# EAGLE design MicroSD_reg (EAGLE 6.2)
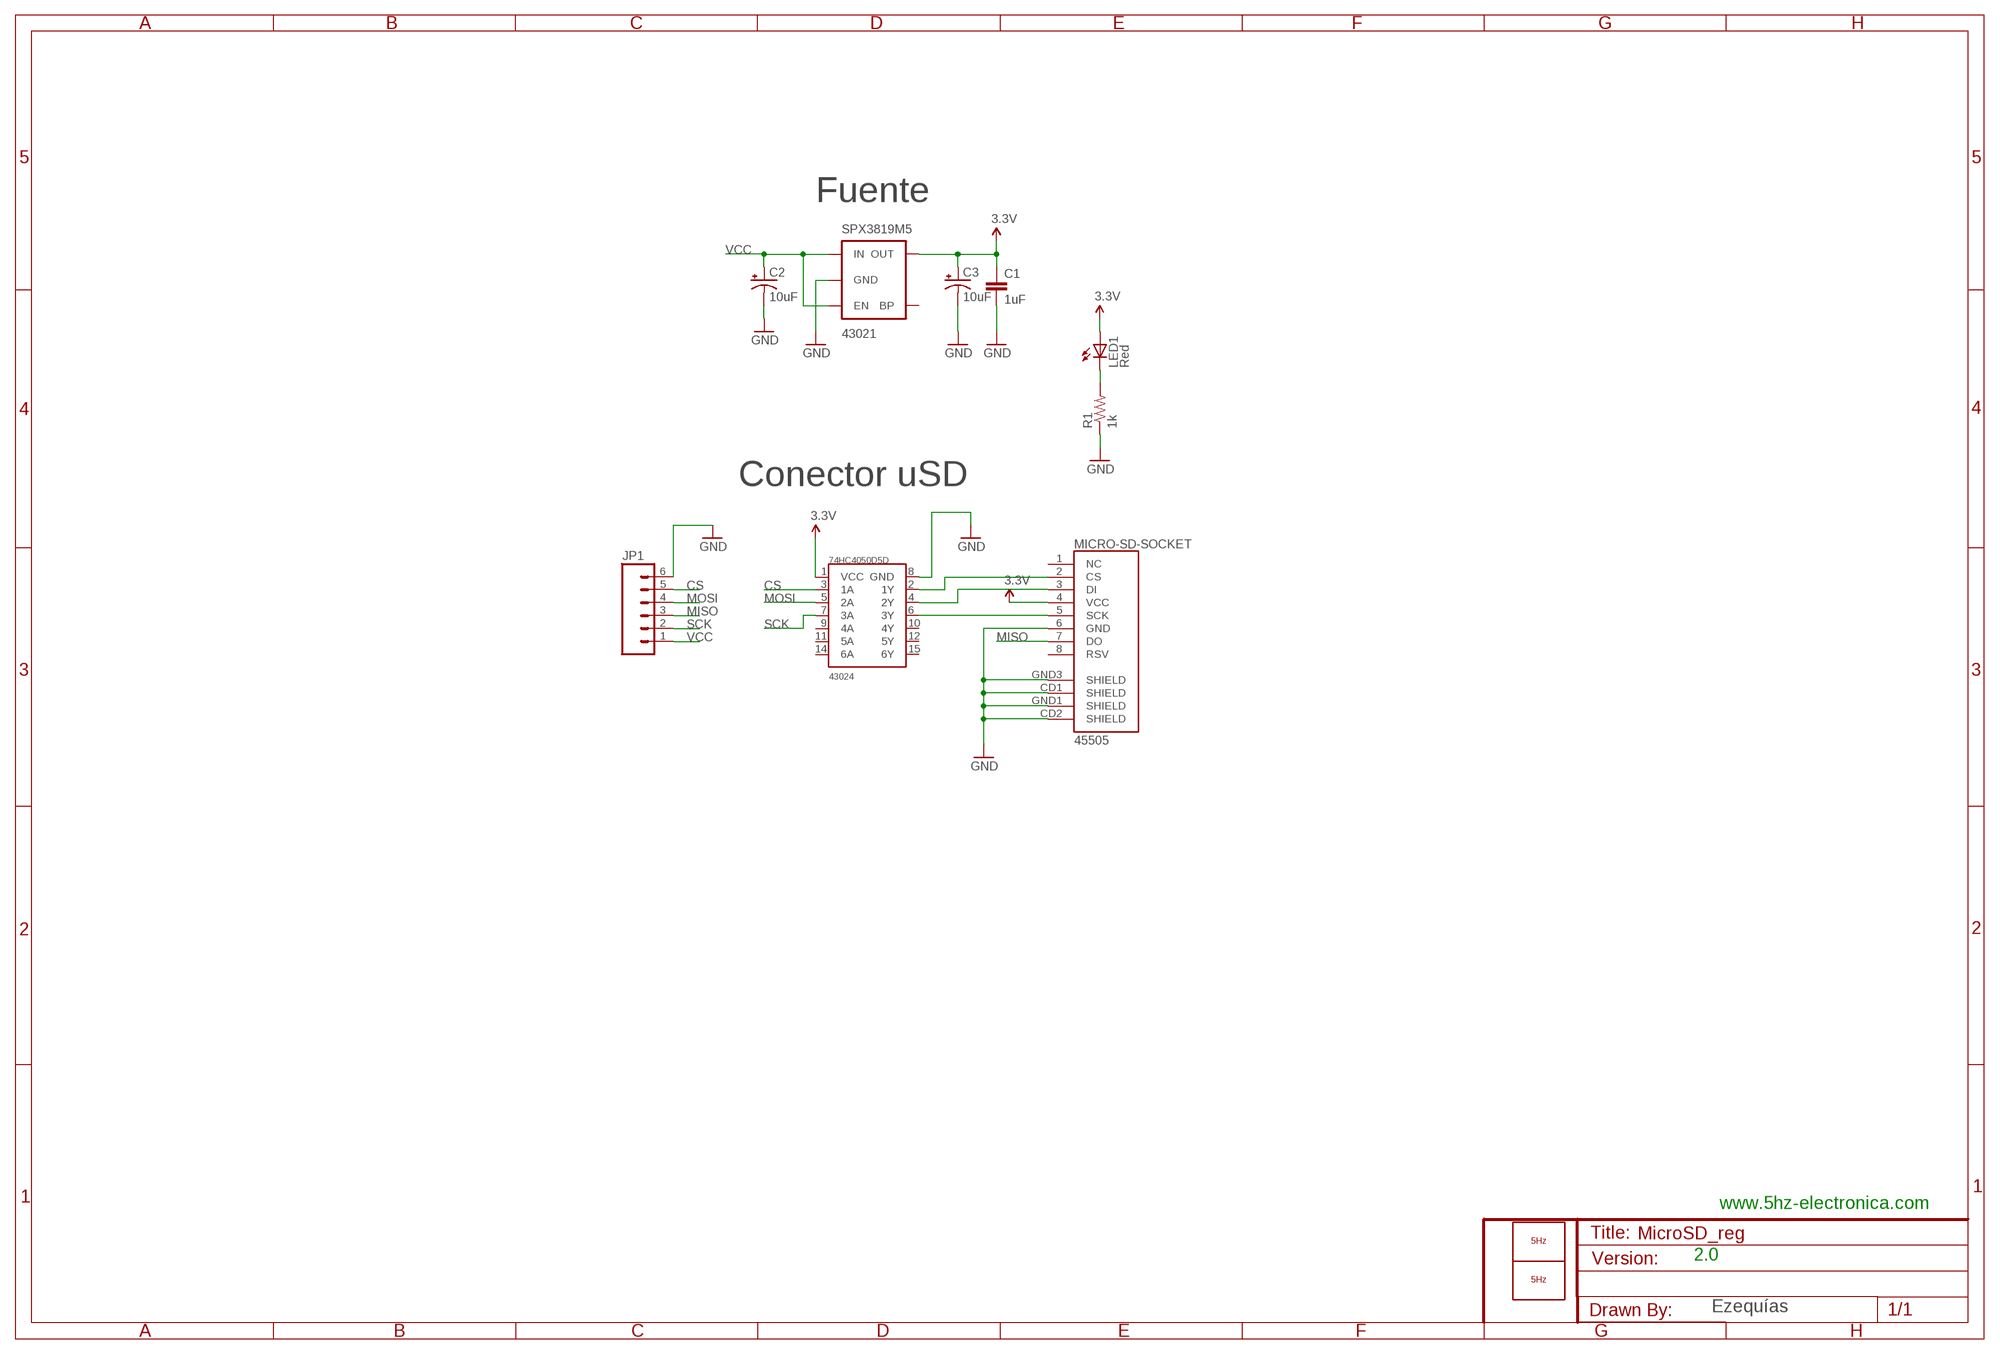
[diagram p0: schematic, sheet 1]

## Parts
74HC4050D5D  43024  HEX_CONVERTER  [SO016]
C1  1uF  CAP0603-CAP  [0603-CAP]
C2  10uF  CAP_POL1206  [EIA3216]
C3  10uF  CAP_POL1206  [EIA3216]
JP1  M06SIP  [1X06]
LED1  Red  LED0603  [LED-0603]
LOGO1  LOGO_5HZ_MAIN_10MM  [5HZ_LOGO_MAIN_10MM]
LOGO2  LOGO_5HZ_CIRC_3MM  [5HZ_LOGO_CIRC_3MM]
MICRO-SD-SOCKET  45505  USD-SOCKETNEW  [MICRO-SD-SOCKET-PP]
R1  1k  RESISTOR0603-RES  [0603-RES]
SPX3819M5  43021  V_REG_LDOSMD  [SOT23-5]

## Nets
3.3V: 74HC4050D5D.1(VCC) C1.1 C3.A(+) LED1.A MICRO-SD-SOCKET.4(VCC) SPX3819M5.5(OUT)
CS: 74HC4050D5D.3(1A) JP1.5
GND: 74HC4050D5D.8(GND) C1.2 C2.C(-) C3.C(-) JP1.6 MICRO-SD-SOCKET.6(GND) MICRO-SD-SOCKET.CD1(SHIELD) MICRO-SD-SOCKET.CD2(SHIELD) MICRO-SD-SOCKET.GND1(SHIELD) MICRO-SD-SOCKET.GND3(SHIELD) R1.1 SPX3819M5.2(GND)
MISO: JP1.3 MICRO-SD-SOCKET.7(DO)
MOSI: 74HC4050D5D.5(2A) JP1.4
N$2: 74HC4050D5D.4(2Y) MICRO-SD-SOCKET.3(DI)
N$4: 74HC4050D5D.6(3Y) MICRO-SD-SOCKET.5(SCK)
N$6: LED1.C R1.2
N$163: 74HC4050D5D.2(1Y) MICRO-SD-SOCKET.2(CS)
SCK: 74HC4050D5D.7(3A) JP1.2
VCC: C2.A(+) JP1.1 SPX3819M5.1(IN) SPX3819M5.3(EN)
Unconnected: 74HC4050D5D.9(4A) 74HC4050D5D.10(4Y) 74HC4050D5D.11(5A) 74HC4050D5D.12(5Y) 74HC4050D5D.14(6A) 74HC4050D5D.15(6Y) MICRO-SD-SOCKET.1(NC) MICRO-SD-SOCKET.8(RSV) SPX3819M5.4(BP)

## Notes on the sheet
- Fuente
- Conector uSD
- www.5hz-electronica.com
- 2.0
- Ezequías

## Library data of the parts
74HC4050D5D = SparkFun:HEX_CONVERTER
C1 = SparkFun:CAP: Capacitor Standard 0603 ceramic capacitor, and 0.1" leaded capacitor.
C2 C3 = SparkFun:CAP_POL: Capacitor Polarized These are standard SMD and PTH capacitors. Normally 10uF, 47uF, and 100uF in electrolytic and tantalum varieties. Always verify the external diameter of the through hole cap, it varies with capacity, voltage, and manufacturer. The EIA devices should be standard.
JP1 = SparkFun:M06: Header 6 Standard 6-pin 0.1" header. Use with straight break away headers (SKU : PRT-00116), right angle break away headers (PRT-00553), swiss pins (PRT-00743), machine pins (PRT-00117), and female headers (PRT-00115). Molex polarized connector foot print use with SKU : PRT-08094 with associated crimp pins and housings. NOTES ON THE VARIANTS LOCK and LOCK_LONGPADS... This footprint was designed to help hold the alignment of a through-hole component (i.e. 6-pin header) while soldering it into place. You may notice that each hole has been shifted either up or down by 0.005 of an inch from it's more standard position (which is a perfectly straight line). This slight alteration caused the pins (the squares in the middle) to touch the edges of the holes. Because they are alternating, it causes a "brace" to hold the component in place. 0.005 has proven to be the perfect amount of "off-center" position when using our standard breakaway headers. Although looks a little odd when you look at the bare footprint, once you have a header in there, the alteration is very hard to notice. Also, if you push a header all the way into place, it is covered up entirely on the bottom side. This idea of altering the position of holes to aid alignment will be further integrated into the Sparkfun Library for other footprints. It can help hold any component with 3 or more connection pins.
LED1 = SparkFun:LED: LEDs Standard schematic elements and footprints for 5mm, 3mm, 1206, and 0603 sized LEDs. 5mm - Spark Fun Electronics SKU : COM-00529 (and others)
LOGO1 LOGO2 = 5hz-electronica:LOGO_5HZ: Logotipo 5Hz "según Pedro"
MICRO-SD-SOCKET = SparkFun:USD-SOCKET: microSD Socket Push-push type uSD socket. Schematic element and footprint production proven. Spark Fun Electronics SKU : PRT-00127. tDoc lines correctly indicate media card edge positions when inserting (unlocked, locked, depressed).
R1 = SparkFun:RESISTOR: Resistor Basic schematic elements and footprints for 0603, 1206, and PTH 1/10th watt (small) resistors.
SPX3819M5 = SparkFun:V_REG_LDO: Voltage Regulator LDO Standard 150mA LDO voltage regulator in SOT-23 layout. Micrel part MIC5205. BP (by-pass) pin is used to lower output noise with 470pF cap.

## Board
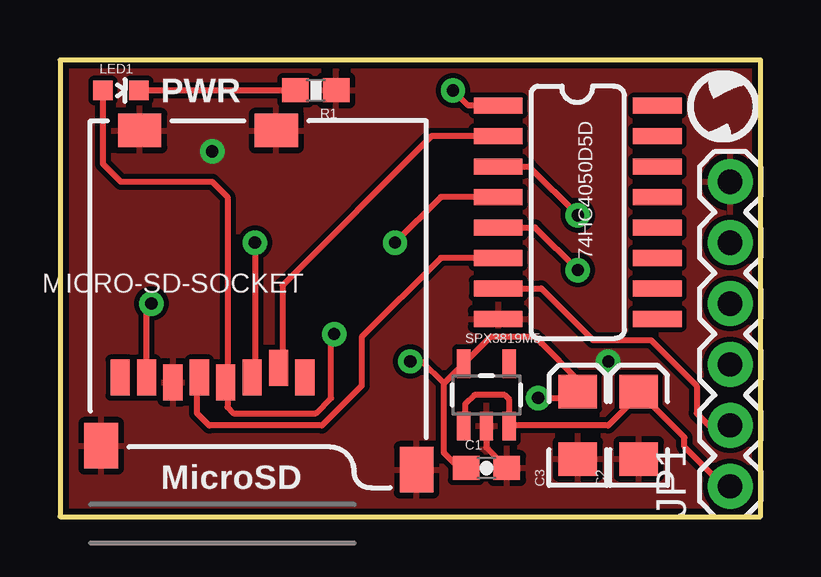
[diagram p1: board, top side]
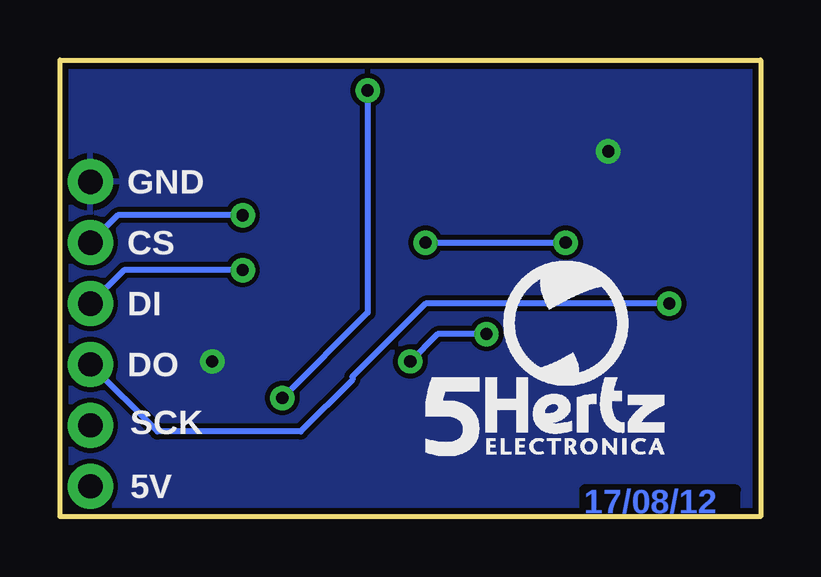
[diagram p2: board, bottom side, seen from below]

Size 29.21 x 19.05 mm. Coordinates in mm from the lower left corner, seen from the top.
Outline: 0,0 29.21,0 29.21,19.05 0,19.05 0,0
Copper layers (1*16): Top 0.035mm / dielectric 1.5mm / Bottom 0.035mm
Design rules: minimum track width 8mil, minimum drill 20mil, track to track 8mil, track to pad 8mil, pad to pad 8mil, via to via 8mil, smd to smd 8mil, copper to edge 10mil, drill to drill 8mil, minimum pad ring 12mil, minimum via ring 10mil, stop-mask expansion 4mil, vias tented up to drill 25mil, thermal gap 10mil

### Footprints (pad centres in the part's own frame; a part is rotated, then mirrored left to right if it is on the bottom)
SO016 = smd 0.66 x 2.032: 1 -4.445,-3.315; 2 -3.175,-3.315; 3 -1.905,-3.315; 4 -0.635,-3.315; 5 0.635,-3.315; 6 1.905,-3.315; 7 3.175,-3.315; 8 4.445,-3.315; 9 4.445,3.315; 10 3.175,3.315; 11 1.905,3.315; 12 0.635,3.315; 13 -0.635,3.315; 14 -1.905,3.315; 15 -3.175,3.315; 16 -4.445,3.315
0603-CAP = smd 1.1 x 1: 1 -0.85,0; 2 0.85,0
EIA3216 = smd 1.4 x 1.6: A 1.4,0; C -1.4,0
1X06 = drill 1.016 pad 1.88: 1 0,0; 2 2.54,0; 3 5.08,0; 4 7.62,0; 5 10.16,0; 6 12.7,0
LED-0603 = smd 0.8 x 0.8: A 0,-0.75; C 0,0.75
MICRO-SD-SOCKET-PP = smd 0.8 x 1.5: 1 -8.94,10.7; 2 -7.84,10.3; 3 -6.74,10.7; 4 -5.64,10.9; 5 -4.54,10.7; 6 -3.44,10.9; 7 -2.34,10.7; 8 -1.24,10.7 | smd 1.8 x 1.4: CD1 -2.05,0.4; CD2 -7.75,0.4 | smd 1.4 x 1.9: GND1 -13.6,14.55; GND3 -0.45,13.55
0603-RES = smd 1.1 x 1: 1 -0.85,0; 2 0.85,0
SOT23-5 = smd 0.55 x 1.2: 1 -0.95,-1.3; 2 0,-1.3; 3 0.95,-1.3; 4 0.95,1.3; 5 -0.95,1.3

### Placement (x,y rotation side)
74HC4050D5D  21.59,12.7 270 top
C1  17.78,2.03 0 top
C2  24.13,3.81 90 top
C3  21.59,3.81 90 top
JP1  27.94,1.27 90 top
LED1  2.54,17.78 270 top
LOGO1  13.97,2.54 0 bottom
LOGO2  26.16,15.62 0 top
MICRO-SD-SOCKET  1.27,16.51 180 top
R1  10.67,17.78 180 top
SPX3819M5  17.78,5.08 0 top

### Tracks (layer width: path | path; a pad name or v marks a point on that pad's centre or on a via)
3.3V  (via drill 0.51)
  Top 0.254: LED1.A 1.79,14.72 2.54,13.97 6.35,13.97 6.99,13.34 6.99,5.68 | 6.99,5.68 MICRO-SD-SOCKET.4 | C1.1 16.64,2.03 16,2.67 16,5.55 | 16,5.55 SPX3819M5.5 17.94,7.49 19.81,7.49 20.07,7.24 21.59,5.71 C3.A 21.33,4.95 v19.94,4.95 | 74HC4050D5D.1 17.02,17.14 v16.38,17.78 | 6.99,5.68 6.99,4.57 7.24,4.32 10.67,4.32 11.3,4.95 11.3,7.49 v11.43,7.62 | v14.61,6.48 15.08,6.48 16,5.55
  Bottom 0.254: v16.38,17.78 16.38,8.51 v19.94,4.95 | v11.43,7.62 13.46,7.62 v14.61,6.48
CS  (via drill 0.51)
  Top 0.254: 74HC4050D5D.3 19.56,14.61 v21.59,12.57
  Bottom 0.254: v21.59,12.57 26.8,12.57 JP1.5
GND  (via drill 0.51)
  Top 0.254: SPX3819M5.2 17.78,2.88 C1.2
  other vias: 22.86,6.48 6.35,15.24
  pour Bottom: 0,19.05 29.21,19.05 29.21,0 0,0
  pour Top: 0,19.05 29.21,19.05 29.21,0 0,0
MISO  (via drill 0.51)
  Top 0.254: MICRO-SD-SOCKET.7 3.61,8.69 v3.81,8.89
  Bottom 0.254: v3.81,8.89 13.97,8.89 17.02,5.84 17.02,5.71 19.18,3.56 25.15,3.56 JP1.3
MOSI  (via drill 0.51)
  Top 0.254: 74HC4050D5D.5 19.81,12.06 v21.59,10.29
  Bottom 0.254: v21.59,10.29 26.54,10.29 JP1.4
N$2  (via drill 0.51)
  Top 0.254: 74HC4050D5D.4 15.88,13.34 v13.97,11.43 | v8.13,11.43 8.13,5.93 MICRO-SD-SOCKET.3
  Bottom 0.254: v13.97,11.43 v8.13,11.43
N$4
  Top 0.254: 74HC4050D5D.6 15.88,10.79 12.57,7.49 12.57,5.46 10.92,3.81 6.22,3.81 5.71,4.32 5.71,5.71 MICRO-SD-SOCKET.5
N$6
  Top 0.254: LED1.C R1.2
N$163
  Top 0.254: 74HC4050D5D.2 15.49,15.88 9.27,9.65 9.27,6.37 MICRO-SD-SOCKET.2
SCK
  Top 0.254: 74HC4050D5D.7 20.07,9.53 22.23,7.37 24.64,7.37 26.54,5.46 26.54,4.32 27.18,3.68 27.81,3.68 JP1.2
VCC
  Top 0.254: JP1.1 27.69,1.27 26.04,2.92 26.04,3.31 C2.A 24.13,5.08 22.86,3.81 18.76,3.81 SPX3819M5.3 18.73,4.89 18.54,5.08 17.27,5.08 16.89,4.7 16.89,3.84 SPX3819M5.1

### Text on the board
Bottom: 17/08/12
tPlace: PWR | MicroSD
bPlace: GND | CS | DI | DO | SCK | 5V